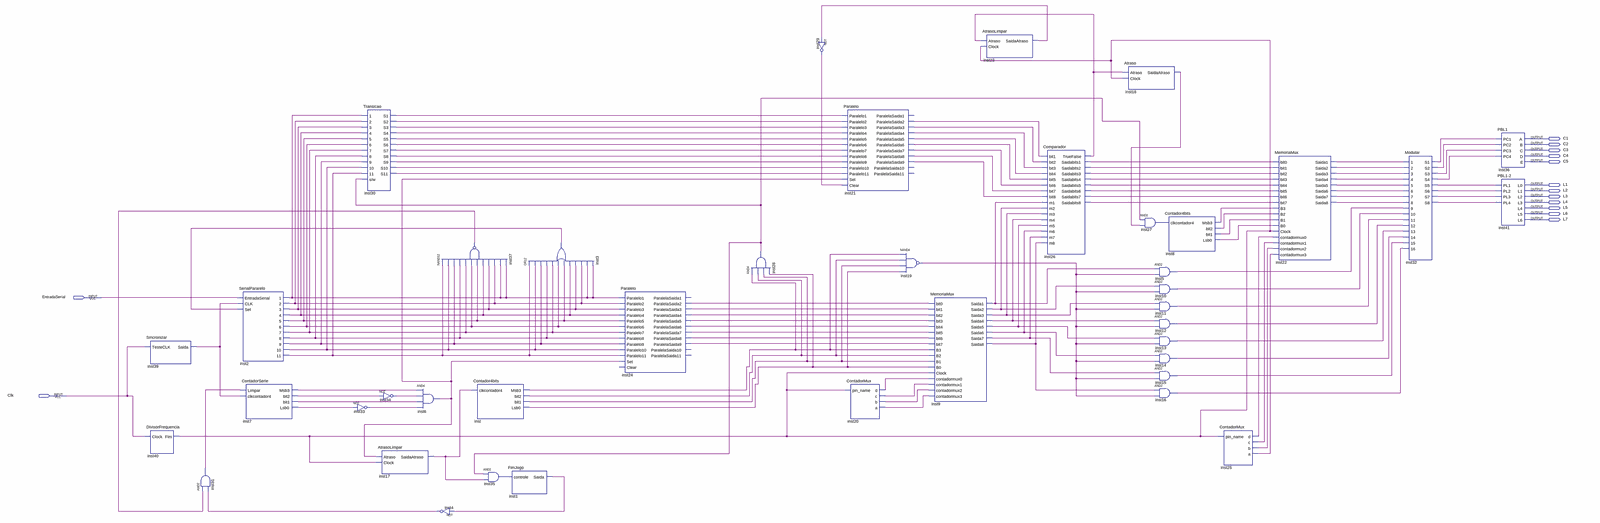
[diagram p0: schematic sheet, whole]
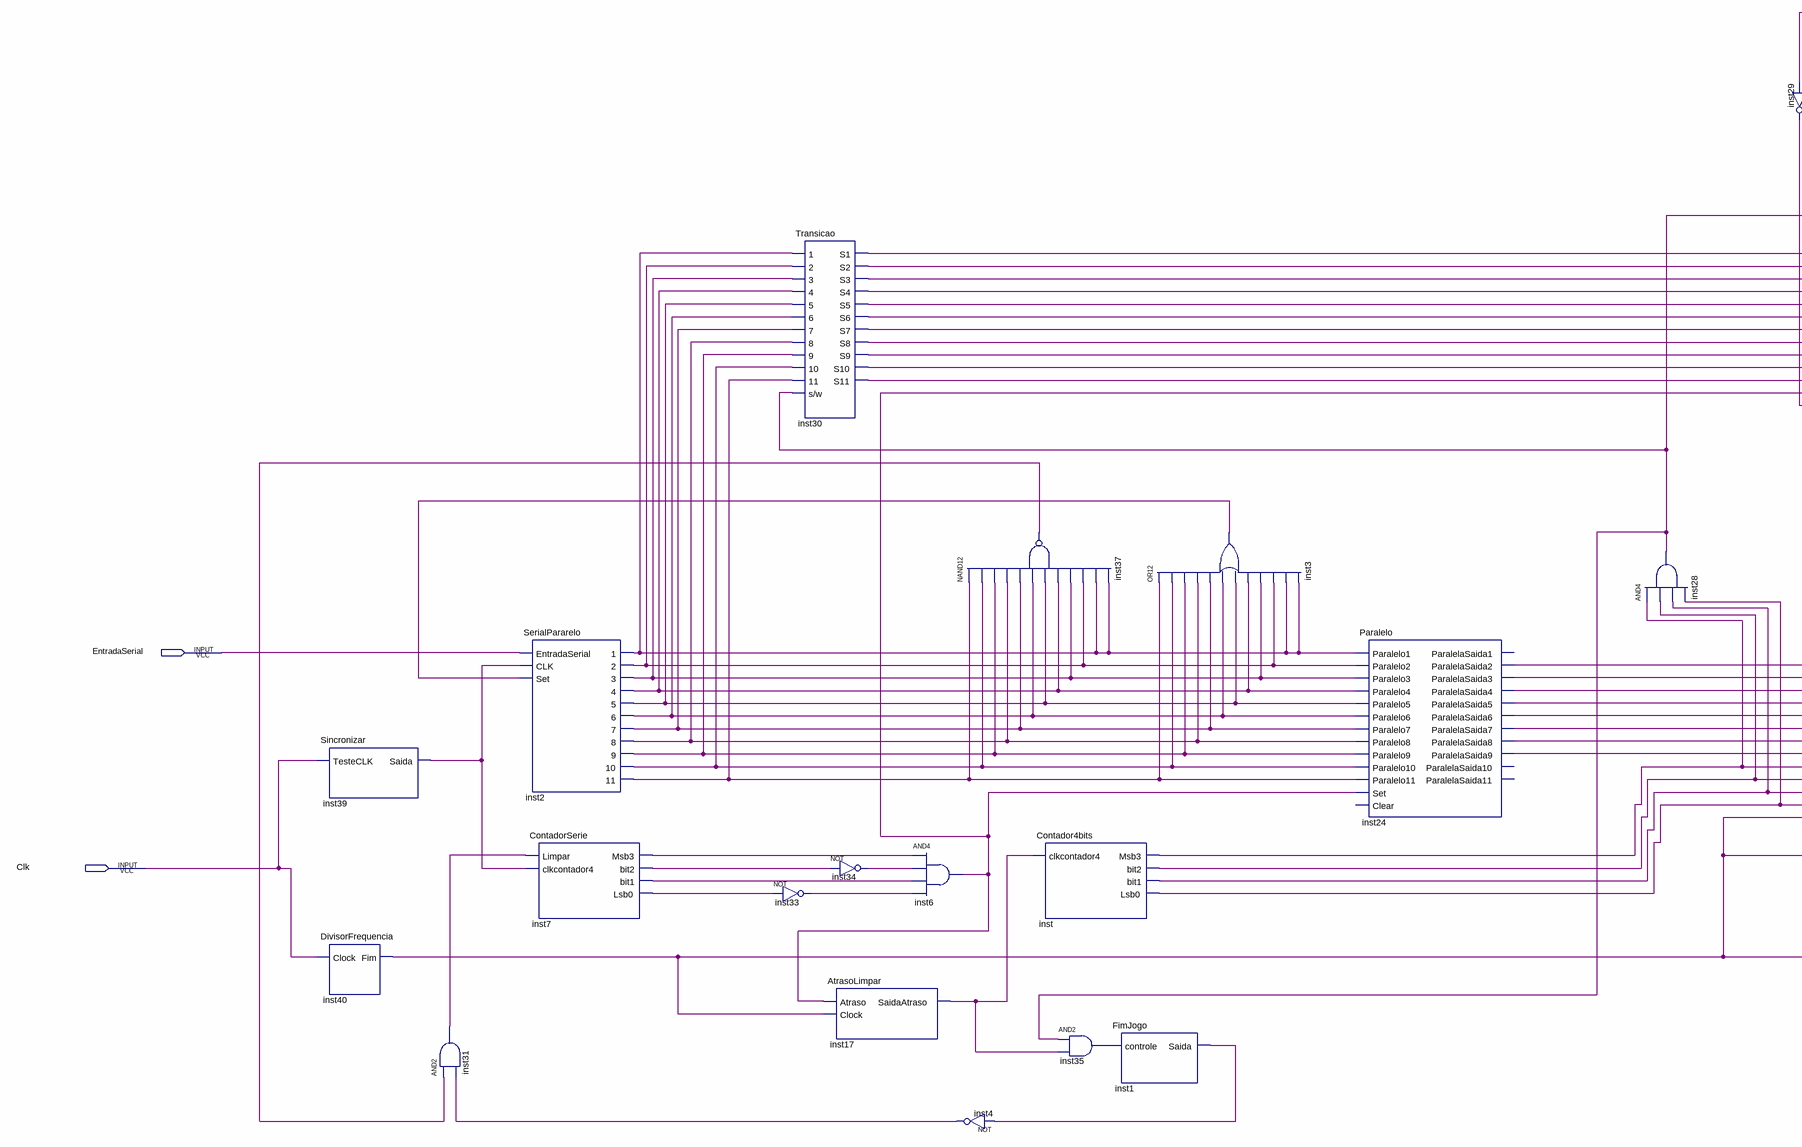
[diagram p1: schematic sheet, left part]
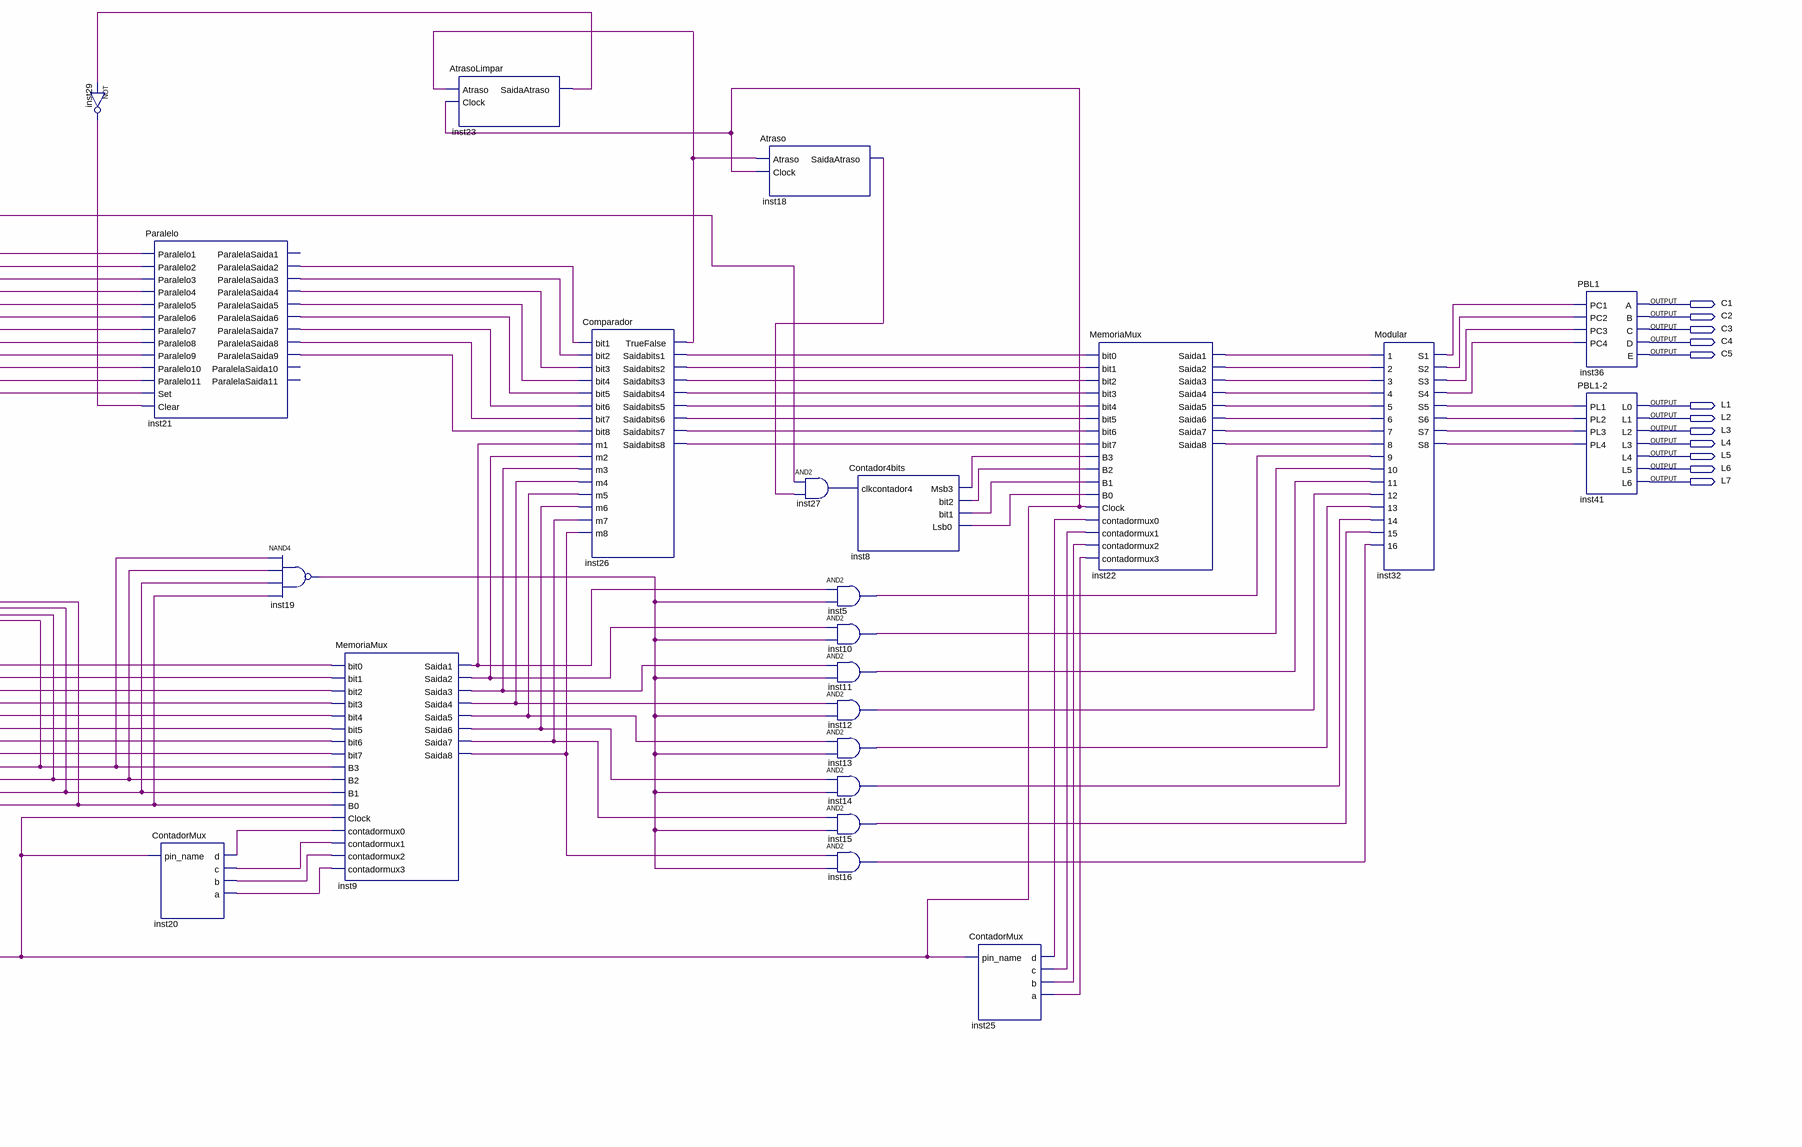
[diagram p2: schematic sheet, right part]
// Quartus schematic PBL4.bdf as structural Verilog: 41 symbols, 14 pins
module PBL4 (
  input  EntradaSerial,
  input  Clk,
  output C1,
  output C2,
  output C3,
  output C4,
  output C5,
  output L1,
  output L2,
  output L3,
  output L4,
  output L5,
  output L6,
  output L7
);

  wire inst1_saida, inst2_1, inst2_2, inst2_3, inst2_4, inst2_5, inst2_6, inst2_7, inst2_8, inst2_9,
       inst2_10, inst2_11, inst3_out, inst4_out, inst5_out, inst6_out, inst7_bit1, inst7_bit2, inst7_lsb0,
       inst7_msb3, inst8_bit1, inst8_bit2, inst8_lsb0, inst8_msb3, inst9_saida1, inst9_saida2, inst9_saida3,
       inst9_saida4, inst9_saida5, inst9_saida6, inst9_saida7, inst9_saida8, inst10_out, inst11_out,
       inst12_out, inst13_out, inst14_out, inst15_out, inst16_out, inst17_saidaatraso, inst18_saidaatraso,
       inst19_out, inst20_a, inst20_b, inst20_c, inst20_d, inst21_paralelasaida2, inst21_paralelasaida3,
       inst21_paralelasaida4, inst21_paralelasaida5, inst21_paralelasaida6, inst21_paralelasaida7,
       inst21_paralelasaida8, inst21_paralelasaida9, inst22_saida1, inst22_saida2, inst22_saida3,
       inst22_saida4, inst22_saida5, inst22_saida6, inst22_saida7, inst22_saida8, inst23_saidaatraso,
       inst24_paralelasaida2, inst24_paralelasaida3, inst24_paralelasaida4, inst24_paralelasaida5,
       inst24_paralelasaida6, inst24_paralelasaida7, inst24_paralelasaida8, inst24_paralelasaida9, inst25_a,
       inst25_b, inst25_c, inst25_d, inst26_saidabits1, inst26_saidabits2, inst26_saidabits3,
       inst26_saidabits4, inst26_saidabits5, inst26_saidabits6, inst26_saidabits7, inst26_saidabits8,
       inst26_truefalse, inst27_out, inst28_out, inst29_out, inst30_s1, inst30_s2, inst30_s3, inst30_s4,
       inst30_s5, inst30_s6, inst30_s7, inst30_s8, inst30_s9, inst30_s10, inst30_s11, inst31_out, inst32_s1,
       inst32_s2, inst32_s3, inst32_s4, inst32_s5, inst32_s6, inst32_s7, inst32_s8, inst33_out, inst34_out,
       inst35_out, inst37_out, inst39_saida, inst40_fim, inst_bit1, inst_bit2, inst_lsb0, inst_msb3;

  Sincronizar inst39 (.TesteCLK(Clk), .Saida(inst39_saida));
  DivisorFrequencia inst40 (.Clock(Clk), .Fim(inst40_fim));
  and inst31 (inst31_out, inst37_out, inst4_out);
  SerialPararelo inst2 (
    .EntradaSerial(EntradaSerial), .CLK(inst39_saida), .Set(inst3_out), .\10 (inst2_10), .\11 (inst2_11),
    .\1 (inst2_1), .\2 (inst2_2), .\3 (inst2_3), .\4 (inst2_4), .\5 (inst2_5), .\6 (inst2_6), .\7 (inst2_7),
    .\8 (inst2_8), .\9 (inst2_9));
  ContadorSerie inst7 (
    .Limpar(inst31_out), .clkcontador4(inst39_saida), .Msb3(inst7_msb3), .bit2(inst7_bit2),
    .bit1(inst7_bit1), .Lsb0(inst7_lsb0));
  not inst33 (inst33_out, inst7_lsb0);
  Transicao inst30 (
    .\1 (inst2_1), .\2 (inst2_2), .\3 (inst2_3), .\4 (inst2_4), .\5 (inst2_5), .\6 (inst2_6), .\7 (inst2_7),
    .\8 (inst2_8), .\9 (inst2_9), .\10 (inst2_10), .\11 (inst2_11), .\s/w (inst28_out), .S1(inst30_s1),
    .S2(inst30_s2), .S3(inst30_s3), .S4(inst30_s4), .S5(inst30_s5), .S6(inst30_s6), .S7(inst30_s7),
    .S8(inst30_s8), .S9(inst30_s9), .S10(inst30_s10), .S11(inst30_s11));
  not inst34 (inst34_out, inst7_bit2);
  AtrasoLimpar inst17 (.Atraso(inst6_out), .Clock(inst40_fim), .SaidaAtraso(inst17_saidaatraso));
  and inst6 (inst6_out, inst7_msb3, inst34_out, inst7_bit1, inst33_out);
  nand inst37 (inst37_out, inst2_11, inst2_10, inst2_9, inst2_8, inst2_7, inst2_6, inst2_5, inst2_4, inst2_3, inst2_2, inst2_1, inst2_1);
  not inst4 (inst4_out, inst1_saida);
  Contador4bits inst (
    .clkcontador4(inst17_saidaatraso), .Msb3(inst_msb3), .bit2(inst_bit2), .bit1(inst_bit1), .Lsb0(inst_lsb0));
  and inst35 (inst35_out, inst28_out, inst17_saidaatraso);
  FimJogo inst1 (.controle(inst35_out), .Saida(inst1_saida));
  or inst3 (inst3_out, inst2_11, inst2_10, inst2_9, inst2_8, inst2_7, inst2_6, inst2_5, inst2_4, inst2_3, inst2_2, inst2_1, inst2_1);
  Paralelo inst24 (
    .Paralelo1(inst2_1), .Paralelo2(inst2_2), .Paralelo3(inst2_3), .Paralelo4(inst2_4), .Paralelo5(inst2_5),
    .Paralelo6(inst2_6), .Paralelo7(inst2_7), .Paralelo8(inst2_8), .Paralelo9(inst2_9),
    .Paralelo10(inst2_10), .Paralelo11(inst2_11), .Set(inst6_out), .ParalelaSaida2(inst24_paralelasaida2),
    .ParalelaSaida3(inst24_paralelasaida3), .ParalelaSaida4(inst24_paralelasaida4),
    .ParalelaSaida5(inst24_paralelasaida5), .ParalelaSaida6(inst24_paralelasaida6),
    .ParalelaSaida7(inst24_paralelasaida7), .ParalelaSaida8(inst24_paralelasaida8),
    .ParalelaSaida9(inst24_paralelasaida9));  // open: Clear, ParalelaSaida1, ParalelaSaida10, ParalelaSaida11
  and inst28 (inst28_out, inst_msb3, inst_bit2, inst_bit1, inst_lsb0);
  not inst29 (inst29_out, inst23_saidaatraso);
  Paralelo inst21 (
    .Paralelo1(inst30_s1), .Paralelo2(inst30_s2), .Paralelo3(inst30_s3), .Paralelo4(inst30_s4),
    .Paralelo5(inst30_s5), .Paralelo6(inst30_s6), .Paralelo7(inst30_s7), .Paralelo8(inst30_s8),
    .Paralelo9(inst30_s9), .Paralelo10(inst30_s10), .Paralelo11(inst30_s11), .Set(inst6_out),
    .Clear(inst29_out), .ParalelaSaida2(inst21_paralelasaida2), .ParalelaSaida3(inst21_paralelasaida3),
    .ParalelaSaida4(inst21_paralelasaida4), .ParalelaSaida5(inst21_paralelasaida5),
    .ParalelaSaida6(inst21_paralelasaida6), .ParalelaSaida7(inst21_paralelasaida7),
    .ParalelaSaida8(inst21_paralelasaida8), .ParalelaSaida9(inst21_paralelasaida9));  // open: ParalelaSaida1, ParalelaSaida10, ParalelaSaida11
  ContadorMux inst20 (.pin_name(inst40_fim), .d(inst20_d), .c(inst20_c), .b(inst20_b), .a(inst20_a));
  nand inst19 (inst19_out, inst_msb3, inst_bit2, inst_bit1, inst_lsb0);
  MemoriaMux inst9 (
    .bit0(inst24_paralelasaida2), .bit1(inst24_paralelasaida3), .bit2(inst24_paralelasaida4),
    .bit3(inst24_paralelasaida5), .bit4(inst24_paralelasaida6), .bit5(inst24_paralelasaida7),
    .bit6(inst24_paralelasaida8), .bit7(inst24_paralelasaida9), .B3(inst_msb3), .B2(inst_bit2),
    .B1(inst_bit1), .B0(inst_lsb0), .Clock(inst40_fim), .contadormux0(inst20_d), .contadormux1(inst20_c),
    .contadormux2(inst20_b), .contadormux3(inst20_a), .Saida1(inst9_saida1), .Saida2(inst9_saida2),
    .Saida3(inst9_saida3), .Saida4(inst9_saida4), .Saida5(inst9_saida5), .Saida6(inst9_saida6),
    .Saida7(inst9_saida7), .Saida8(inst9_saida8));
  AtrasoLimpar inst23 (.Atraso(inst26_truefalse), .Clock(inst40_fim), .SaidaAtraso(inst23_saidaatraso));
  Comparador inst26 (
    .bit1(inst21_paralelasaida2), .m8(inst9_saida8), .bit2(inst21_paralelasaida3),
    .bit3(inst21_paralelasaida4), .bit4(inst21_paralelasaida5), .bit5(inst21_paralelasaida6),
    .bit6(inst21_paralelasaida7), .bit7(inst21_paralelasaida8), .bit8(inst21_paralelasaida9),
    .m1(inst9_saida1), .m2(inst9_saida2), .m3(inst9_saida3), .m4(inst9_saida4), .m5(inst9_saida5),
    .m6(inst9_saida6), .m7(inst9_saida7), .TrueFalse(inst26_truefalse), .Saidabits1(inst26_saidabits1),
    .Saidabits2(inst26_saidabits2), .Saidabits3(inst26_saidabits3), .Saidabits4(inst26_saidabits4),
    .Saidabits5(inst26_saidabits5), .Saidabits6(inst26_saidabits6), .Saidabits7(inst26_saidabits7),
    .Saidabits8(inst26_saidabits8));
  Atraso inst18 (.Atraso(inst26_truefalse), .Clock(inst40_fim), .SaidaAtraso(inst18_saidaatraso));
  and inst27 (inst27_out, inst28_out, inst18_saidaatraso);
  Contador4bits inst8 (
    .clkcontador4(inst27_out), .Msb3(inst8_msb3), .bit2(inst8_bit2), .bit1(inst8_bit1), .Lsb0(inst8_lsb0));
  and inst5 (inst5_out, inst9_saida1, inst19_out);
  and inst10 (inst10_out, inst9_saida2, inst19_out);
  and inst11 (inst11_out, inst9_saida3, inst19_out);
  and inst12 (inst12_out, inst9_saida4, inst19_out);
  and inst13 (inst13_out, inst9_saida5, inst19_out);
  and inst14 (inst14_out, inst9_saida6, inst19_out);
  and inst15 (inst15_out, inst9_saida7, inst19_out);
  and inst16 (inst16_out, inst9_saida8, inst19_out);
  ContadorMux inst25 (.pin_name(inst40_fim), .d(inst25_d), .c(inst25_c), .b(inst25_b), .a(inst25_a));
  MemoriaMux inst22 (
    .bit0(inst26_saidabits1), .bit1(inst26_saidabits2), .bit2(inst26_saidabits3), .bit3(inst26_saidabits4),
    .bit4(inst26_saidabits5), .bit5(inst26_saidabits6), .bit6(inst26_saidabits7), .bit7(inst26_saidabits8),
    .B3(inst8_msb3), .B2(inst8_bit2), .B1(inst8_bit1), .B0(inst8_lsb0), .Clock(inst40_fim),
    .contadormux0(inst25_d), .contadormux1(inst25_c), .contadormux2(inst25_b), .contadormux3(inst25_a),
    .Saida1(inst22_saida1), .Saida2(inst22_saida2), .Saida3(inst22_saida3), .Saida4(inst22_saida4),
    .Saida5(inst22_saida5), .Saida6(inst22_saida6), .Saida7(inst22_saida7), .Saida8(inst22_saida8));
  Modular inst32 (
    .\1 (inst22_saida1), .\16 (inst16_out), .\2 (inst22_saida2), .\3 (inst22_saida3), .\4 (inst22_saida4),
    .\5 (inst22_saida5), .\6 (inst22_saida6), .\7 (inst22_saida7), .\8 (inst22_saida8), .\9 (inst5_out),
    .\10 (inst10_out), .\11 (inst11_out), .\12 (inst12_out), .\13 (inst13_out), .\14 (inst14_out),
    .\15 (inst15_out), .S1(inst32_s1), .S2(inst32_s2), .S3(inst32_s3), .S4(inst32_s4), .S5(inst32_s5),
    .S6(inst32_s6), .S7(inst32_s7), .S8(inst32_s8));
  PBL1 inst36 (
    .PC1(inst32_s1), .PC2(inst32_s2), .PC3(inst32_s3), .PC4(inst32_s4), .A(C1), .B(C2), .C(C3), .D(C4), .E(C5));
  \PBL1-2  inst41 (
    .PL1(inst32_s5), .PL2(inst32_s6), .PL3(inst32_s7), .PL4(inst32_s8), .L0(L1), .L1(L2), .L2(L3), .L3(L4),
    .L4(L5), .L5(L6), .L6(L7));
endmodule
